# Altium schematic sheet Voltage_OpAmp.SchDoc
size A4; SheetNumber: 1; SheetTotal: 9
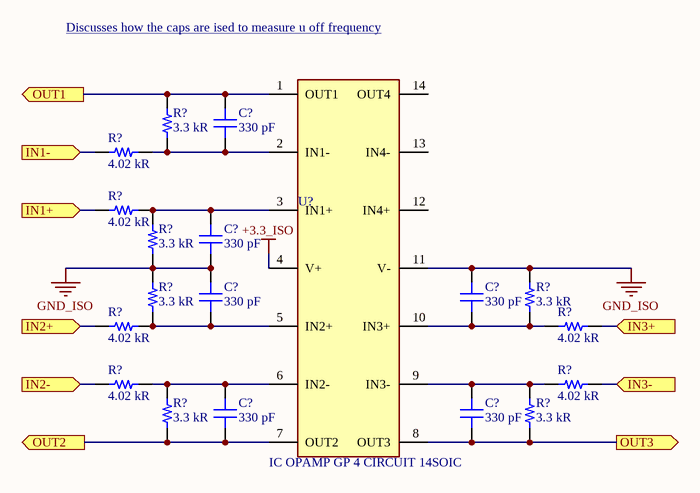
[diagram p0: Voltage_OpAmp.SchDoc]

## Parts
(Parts that share a designator on the sheet are numbered #1, #2 ... from top to bottom, then left to right.)
C?#1  330 pF  [CAP 0402_1005]
C?#2  330 pF  [CAP 0402_1005]
C?#3  330 pF  [CAP 0402_1005]
C?#4  330 pF  [CAP 0402_1005]
C?#5  330 pF  [CAP 0402_1005]
C?#6  330 pF  [CAP 0402_1005]
R?#1  3.3 kR  [RES 0402_1005]
R?#2  4.02 kR  [RES 0402_1005]
R?#3  4.02 kR  [RES 0402_1005]
R?#4  3.3 kR  [RES 0402_1005]
R?#5  3.3 kR  [RES 0402_1005]
R?#6  3.3 kR  [RES 0402_1005]
R?#7  4.02 kR  [RES 0402_1005]
R?#8  4.02 kR  [RES 0402_1005]
R?#9  4.02 kR  [RES 0402_1005]
R?#10  4.02 kR  [RES 0402_1005]
R?#11  3.3 kR  [RES 0402_1005]
R?#12  3.3 kR  [RES 0402_1005]
U?  IC OPAMP GP 4 CIRCUIT 14SOIC  [SOIC127P600X175-14N]

## Ports
IN1+ (in), IN1- (in), IN2+ (in), IN2- (in), IN3+ (in), IN3- (in), OUT1 (out), OUT2 (out), OUT3 (out)

## Nets
+3.3_ISO: U?.4(V+)
GND_ISO: C?#2.1 C?#3.2 C?#4.2 R?#4.1 R?#5.2 R?#6.2 U?.11(V-)
IN1+: R?#3.1 ; port IN1+
IN1-: R?#2.1 ; port IN1-
IN2+: R?#7.1 ; port IN2+
IN2-: R?#9.1 ; port IN2-
IN3+: R?#8.2 ; port IN3+
IN3-: R?#10.2 ; port IN3-
OUT1: C?#1.2 R?#1.2 U?.1(OUT1) ; port OUT1
OUT2: C?#5.1 R?#11.1 U?.7(OUT2) ; port OUT2
OUT3: C?#6.1 R?#12.1 U?.8(OUT3) ; port OUT3
NetC?#1_1: C?#1.1 R?#1.1 R?#2.2 U?.2(IN1-)
NetC?#2_2: C?#2.2 R?#3.2 R?#4.2 U?.3(IN1+)
NetC?#3_1: C?#3.1 R?#5.1 R?#7.2 U?.5(IN2+)
NetC?#4_1: C?#4.1 R?#6.1 R?#8.1 U?.10(IN3+)
NetC?#5_2: C?#5.2 R?#9.2 R?#11.2 U?.6(IN2-)
NetC?#6_2: C?#6.2 R?#10.1 R?#12.2 U?.9(IN3-)

Not connected (* = marked no-connect by the designer): U? 12(IN4+) 13(IN4-) 14(OUT4)

## Notes on the sheet
- Discusses how the caps are ised to measure u off frequency <https://www.ti.com/lit/ug/sbou252/sbou252.pdf?ts=1687733715900&ref_url=https%253A%252F%252Fwww.ti.com%252Fproduct%252FTLV9004-Q1>

## Library data of the parts
C?#1-C?#6 = GCM1555C1H331JA16D: CAP CER 330PF 50V C0G/NP0 0402; manufacturer: Murata Electronics; Temperature Coefficient: C0G, NP0; Tolerance: ±5%; Part Number: GCM1555C1H331JA16D; Value: 330 pF; Applications: Automotive; Capacitance: 330 pF; componentlink1description: Datasheet; componentlink1url: https://www.murata.com/~/media/webrenewal/support/library/catalog/products/capacitor/mlcc/c03e.ashx?la=en-us; componentlink2description: DigiKey Link; componentlink2url: https://www.digikey.com/en/products/detail/murata-electronics/GCM1555C1H331JA16D/1765176; Device Package: 0402 (1005 Metric); lastupdated: 2023-06-25 7:06:19 PM; Lifecycle Status: Active; Minimum Order: 1; Mounting Type: Surface Mount, MLCC; Operating Temperature: -55°C ~ 125°C; Package / Case: 0402 (1005 Metric); packaging: TapeAndReel; partid: 2978; Part Status: Active; price: 0.01; Ratings: AEC-Q200; series: GCM; Size / Dimension: 0.039" L x 0.020" W (1.00mm x 0.50mm); Supplier 1: DigiKey; Supplier Part Number 1: 490-4928-1-ND; Thickness (Max): 0.022" (0.55mm); Voltage - Rated: 50V
R?#1 R?#4-R?#6 R?#11 R?#12 = ERA-2AEB332X: RES SMD 3.3K OHM 0.1% 1/16W 0402; Manufacturer: Panasonic Electronic Components; Power (Watts): 0.063W, 1/16W; Resistance: 3.3 kOhms; Temperature Coefficient: ±25ppm/°C; Part Number: ERA-2AEB332X; Value: 3.3 kR; ComponentLink1Description: Datasheet; ComponentLink1URL: https://industrial.panasonic.com/cdbs/www-data/pdf/RDM0000/AOA0000C307.pdf; ComponentLink2Description: DigiKey Link; ComponentLink2URL: https://www.digikey.com/en/products/detail/panasonic-electronic-components/ERA-2AEB332X/1706017; Composition: Thin Film; Device Package: 0402 (1005 Metric); Features: Automotive AEC-Q200; Height - Seated (Max): 0.016" (0.40mm); LastUpdated: 2023-06-25 7:35:55 PM; Lifecycle Status: Active; Minimum Order: 1; Number of Terminations: 2; Operating Temperature: -55°C ~ 155°C; Package / Case: 0402 (1005 Metric); Packaging: TapeAndReel; PartId: 6110; Part Status: Active; Price: 0.05; Ratings: AEC-Q200; Series: ERA-2A; Size / Dimension: 0.039" L x 0.020" W (1.00mm x 0.50mm); Supplier 1: DigiKey; Supplier Part Number 1: P3.3KDCCT-ND; Supplier Device Package: 0402; Tolerance: ±0.1%
R?#2 R?#3 R?#7-R?#10 = ERA-2AEB4021X: RES SMD 4.02KOHM 0.1% 1/16W 0402; Manufacturer: Panasonic Electronic Components; Power (Watts): 0.063W, 1/16W; Resistance: 4.02 kOhms; Temperature Coefficient: ±25ppm/°C; Part Number: ERA-2AEB4021X; Value: 4.02 kR; ComponentLink1Description: Datasheet; ComponentLink1URL: https://industrial.panasonic.com/cdbs/www-data/pdf/RDM0000/AOA0000C307.pdf; ComponentLink2Description: DigiKey Link; ComponentLink2URL: https://www.digikey.com/en/products/detail/panasonic-electronic-components/ERA-2AEB4021X/2026107; Composition: Thin Film; Device Package: 0402 (1005 Metric); Features: Automotive AEC-Q200; Height - Seated (Max): 0.016" (0.40mm); LastUpdated: 2023-06-25 7:35:55 PM; Lifecycle Status: Active; Minimum Order: 1; Number of Terminations: 2; Operating Temperature: -55°C ~ 155°C; Package / Case: 0402 (1005 Metric); Packaging: TapeAndReel; PartId: 6101; Part Status: Active; Price: 0.05; Ratings: AEC-Q200; Series: ERA-2A; Size / Dimension: 0.039" L x 0.020" W (1.00mm x 0.50mm); Supplier 1: DigiKey; Supplier Part Number 1: P4.02KDCCT-ND; Supplier Device Package: 0402; Tolerance: ±0.1%
U? = TLV9004QDRQ1